# EAGLE design stm8sboard (EAGLE 6.5.0)
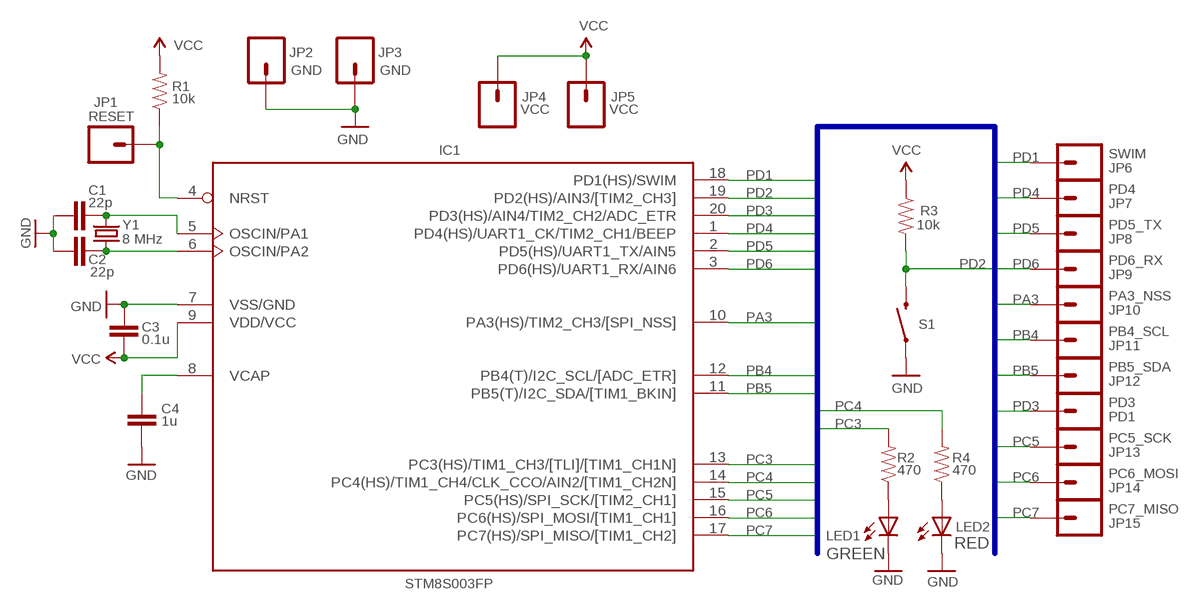
[diagram p0: schematic, sheet 1]

## Parts
C1  22p  CAP0805  [0805]
C2  22p  CAP0805  [0805]
C3  0.1u  CAP0603-CAP  [0603-CAP]
C4  1u  CAP0603-CAP  [0603-CAP]
IC1  STM8S003FP  STM8S103FP  [TSSOP20]
JP1  RESET  M01PTH  [1X01]
JP2  GND  M01PTH  [1X01]
JP3  GND  M01PTH  [1X01]
JP4  VCC  M01PTH  [1X01]
JP5  VCC  M01PTH  [1X01]
JP6  SWIM  M01PTH  [1X01]
JP7  PD4  M01PTH  [1X01]
JP8  PD5_TX  M01PTH  [1X01]
JP9  PD6_RX  M01PTH  [1X01]
JP10  PA3_NSS  M01PTH  [1X01]
JP11  PB4_SCL  M01PTH  [1X01]
JP12  PB5_SDA  M01PTH  [1X01]
JP13  PC5_SCK  M01PTH  [1X01]
JP14  PC6_MOSI  M01PTH  [1X01]
JP15  PC7_MISO  M01PTH  [1X01]
LED1  GREEN  LED0603  [LED-0603]
LED2  RED  LED0603  [LED-0603]
PD1  PD3  M01PTH  [1X01]
R1  10k  RESISTOR0805-RES  [0805]
R2  470  RESISTOR0805-RES  [0805]
R3  10k  RESISTOR0805-RES  [0805]
R4  470  RESISTOR0805-RES  [0805]
S1  SW  SWITCH-MOMENTARY-2PTH_REED2  [REED_SWITCH_PLASTIC]
Y1  8 MHz  CRYSTALHC49UV  [HC49U-V]

## Nets
GND: C1.1 C2.1 C3.1 C4.2 IC1.7(VSS/GND) JP2.1 JP3.1 LED1.C LED2.C S1.P$1
N$1: LED1.A R2.1
N$2: LED2.A R4.1
N$3: C2.2 IC1.6(OSCIN/PA2) Y1.1
N$4: C1.2 IC1.5(OSCIN/PA1) Y1.2
N$7: C4.1 IC1.8(VCAP)
N$10: IC1.4(NRST) JP1.1 R1.1
PA3: IC1.10(PA3(HS)/TIM2_CH3/[SPI_NSS]) JP10.1
PB4: IC1.12(PB4(T)/I2C_SCL/[ADC_ETR]) JP11.1
PB5: IC1.11(PB5(T)/I2C_SDA/[TIM1_BKIN]) JP12.1
PC3: IC1.13(PC3(HS)/TIM1_CH3/[TLI]/[TIM1_CH1N]) R2.2
PC4: IC1.14(PC4(HS)/TIM1_CH4/CLK_CCO/AIN2/[TIM1_CH2N]) R4.2
PC5: IC1.15(PC5(HS)/SPI_SCK/[TIM2_CH1]) JP13.1
PC6: IC1.16(PC6(HS)/SPI_MOSI/[TIM1_CH1]) JP14.1
PC7: IC1.17(PC7(HS)/SPI_MISO/[TIM1_CH2]) JP15.1
PD1: IC1.18(PD1(HS)/SWIM) JP6.1
PD2: IC1.19(PD2(HS)/AIN3/[TIM2_CH3]) R3.2 S1.P$2
PD3: IC1.20(PD3(HS)/AIN4/TIM2_CH2/ADC_ETR) PD1.1
PD4: IC1.1(PD4(HS)/UART1_CK/TIM2_CH1/BEEP) JP7.1
PD5: IC1.2(PD5(HS)/UART1_TX/AIN5) JP8.1
PD6: IC1.3(PD6(HS)/UART1_RX/AIN6) JP9.1
VCC: C3.2 IC1.9(VDD/VCC) JP4.1 JP5.1 R1.2 R3.1

## Buses
PD[1..6],PC[3..7],PA3,PB[4..5]

## Library data of the parts
C1-C4 = SparkFun:CAP: Capacitor Standard 0603 ceramic capacitor, and 0.1" leaded capacitor.
IC1 = stm8s103:STM8S103F*: STM8S103F*
JP1-JP15 PD1 = SparkFun:M01: Header 1 Standard 1-pin 0.1" header. Use with straight break away headers (SKU : PRT-00116), right angle break away headers (PRT-00553), swiss pins (PRT-00743), machine pins (PRT-00117), and female headers (PRT-00115).
LED1 LED2 = SparkFun:LED: LEDs Standard schematic elements and footprints for 5mm, 3mm, 1206, and 0603 sized LEDs. 5mm - Spark Fun Electronics SKU : COM-00529 (and others)
R1-R4 = SparkFun:RESISTOR: Resistor Basic schematic elements and footprints for 0603, 1206, and PTH resistors.
S1 = _MyLib:SWITCH-MOMENTARY-2: Various NO switches- pushbuttons, reed, etc
Y1 = SparkFun:CRYSTAL: Crystals Various standard crystals. Proven footprints. Spark Fun Electronics SKU : COM-00534

## Board
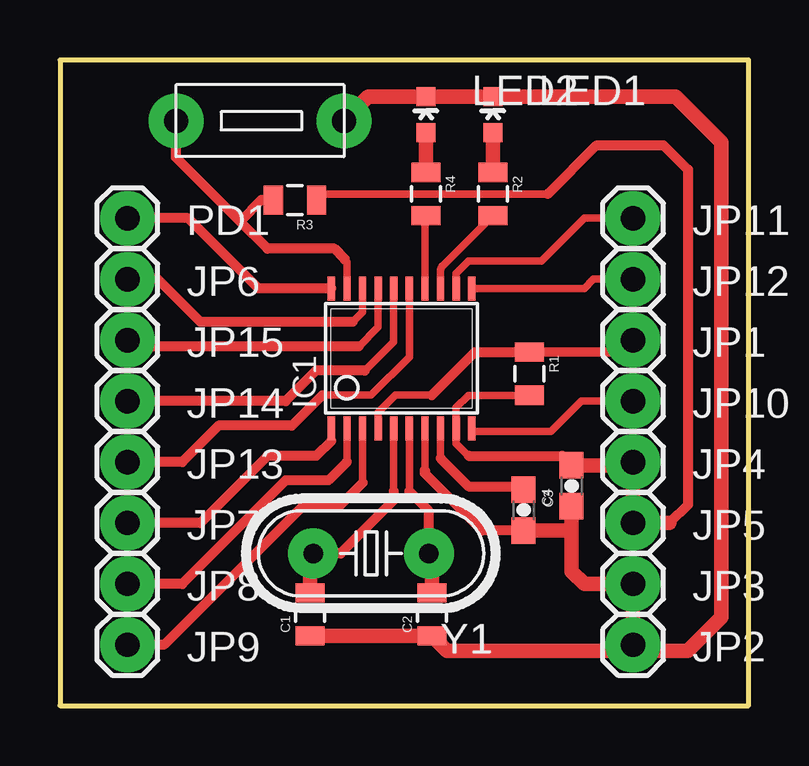
[diagram p1: board, top side]

Size 28.72 x 26.92 mm. Coordinates in mm from the lower left corner, seen from the top.
Outline: 0,26.92 0,0 28.72,0 28.72,26.92 0,26.92
Copper layers (1*16): Top 0.035mm / dielectric 1.5mm / Bottom 0.035mm
Design rules "default": minimum track width 10mil, minimum drill 8mil, track to track 6mil, track to pad 6mil, pad to pad 6mil, via to via 6mil, smd to smd 0mil, copper to edge 20mil, drill to drill 40mil, minimum pad ring 25mil, minimum via ring 12mil, stop-mask expansion 4mil, vias tented up to drill 0mil, thermal gap 10mil

### Footprints (pad centres in the part's own frame; a part is rotated, then mirrored left to right if it is on the bottom)
0805 = smd 0.8 x 1.2: 1 -0.9,0; 2 0.9,0
0603-CAP = smd 1.1 x 1: 1 -0.85,0; 2 0.85,0
TSSOP20 = smd 0.305 x 0.991: 1 -2.925,-2.918; 2 -2.275,-2.918; 3 -1.625,-2.918; 4 -0.975,-2.918; 5 -0.325,-2.918; 6 0.325,-2.918; 7 0.975,-2.918; 8 1.625,-2.918; 9 2.275,-2.918; 10 2.925,-2.918; 11 2.925,2.918; 12 2.275,2.918; 13 1.625,2.918; 14 0.975,2.918; 15 0.325,2.918; 16 -0.325,2.918; 17 -0.975,2.918; 18 -1.625,2.918; 19 -2.275,2.918; 20 -2.925,2.918
1X01 = drill 1.016 pad 1.88: 1 0,0
LED-0603 = smd 0.8 x 0.8: A 0,-0.75; C 0,0.75
REED_SWITCH_PLASTIC = drill 1.016 pad 1.88: P$1 -7,0; P$2 0,0
HC49U-V = drill 0.813: 1 -2.413,0; 2 2.413,0

### Placement (x,y rotation side)
C1  10.43,3.81 90 top
C2  15.51,3.81 90 top
C3  21.33,9.17 90 top
C4  19.33,8.15 270 top
IC1  14.24,14.48 0 top
JP1  23.89,15.24 0 top
JP2  23.89,2.54 0 top
JP3  23.89,5.08 0 top
JP4  23.89,10.16 0 top
JP5  23.89,7.62 0 top
JP6  2.81,17.78 0 top
JP7  2.81,7.62 0 top
JP8  2.81,5.08 0 top
JP9  2.81,2.54 0 top
JP10  23.89,12.7 0 top
JP11  23.89,20.32 0 top
JP12  23.89,17.78 0 top
JP13  2.81,10.16 0 top
JP14  2.81,12.7 0 top
JP15  2.81,15.24 0 top
LED1  18.05,24.64 0 top
LED2  15.26,24.64 0 top
PD1  2.81,20.32 0 top
R1  19.57,13.84 270 top
R2  18.05,21.34 270 top
R3  9.79,21.08 180 top
R4  15.26,21.34 270 top
S1  4.84,24.38 180 top
Y1  12.97,6.35 180 top

### Tracks (layer width: path | path; a pad name or v marks a point on that pad's centre or on a via)
GND
  Top 0.305: IC1.7 15.21,9.82
  Top 0.406: C4.2 17.6,7.3 15.21,9.69 15.21,9.82 | 24.4,2.29 24.15,2.29 JP2.1 | C3.1 21.33,7.3
  Top 0.61: C1.1 C2.1 16.13,2.29 24.4,2.29 26.18,2.29 27.57,3.68 27.57,23.5 25.68,25.39 LED1.C LED2.C 12.85,25.39 S1.P$1 | C3.1 21.33,5.61 21.86,5.08 JP3.1 JP2.1 | 21.33,7.3 C4.2
N$1
  Top 0.61: R2.1 LED1.A
N$2
  Top 0.61: R4.1 LED2.A
N$3
  Top 0.305: IC1.6 14.56,8.94
  Top 0.406: 15.51,6.22 Y1.1 15.38,8.12 14.56,8.94
  Top 0.61: C2.2 15.51,6.22
N$4
  Top 0.305: IC1.5 13.91,8.94
  Top 0.406: 13.91,8.94 13.91,8.56 11.7,6.35 Y1.2 10.43,6.22
  Top 0.61: C1.2 10.43,6.22
N$7
  Top 0.305: IC1.8 15.87,10.31
  Top 0.406: 15.87,10.31 17.03,9.14 19.19,9.14 C4.1
N$10
  Top 0.305: 15.51,12.95 13.99,12.95 13.27,12.23 IC1.4
  Top 0.406: 15.51,12.95 17.3,14.74 R1.1 19.31,14.74 23.13,14.73 JP1.1
PA3
  Top 0.305: 17.29,11.43 17.17,11.43 arc-90 17.16,11.44 IC1.10
  Top 0.308: 17.29,11.43 20.46,11.43 21.73,12.7 JP10.1
PB4
  Top 0.305: 20.08,18.54 17.03,18.54 16.51,18.02 IC1.12
  Top 0.308: 20.08,18.54 21.86,20.32 JP11.1
PB5
  Top 0.308: JP12.1 22.24,17.78 21.86,17.4 IC1.11
PC3
  Top 0.305: IC1.13 15.87,18.12 arc-45 15.95,18.34 R2.2
PC4
  Top 0.305: IC1.14 15.21,20.34 arc-45 R4.2
PC5
  Top 0.305: IC1.15 14.56,14.55 12.97,12.95 10.94,12.95
  Top 0.406: 10.94,12.95 9.67,11.68 6.62,11.68 5.1,10.16 JP13.1
PC6
  Top 0.305: IC1.16 13.91,15.17 12.72,13.97
  Top 0.406: 12.72,13.97 10.68,13.97 9.41,12.7 JP14.1
PC7
  Top 0.305: IC1.17 13.27,15.79 12.46,14.99 | 3.06,14.99 JP15.1
  Top 0.406: 12.46,14.99 3.06,14.99
PD1
  Top 0.305: IC1.18 12.62,16.41 12.21,16
  Top 0.406: 12.21,16 5.86,16 4.08,17.78 JP6.1
PD2
  Top 0.308: 11.87,18.6 11.96,18.5 IC1.19
  Top 0.406: 11.87,18.6 11.87,18.62 arc45 11.87,18.63 11.45,19.05 8.66,19.05 arc-45 8.65,19.05 7.51,20.19 | 7.51,20.19 4.84,22.86 S1.P$2 | R3.2 8.4,21.08 arc45 8.39,21.08 7.51,20.19
PD3
  Top 0.406: IC1.20 8.28,17.4 arc-45 8.27,17.4 5.35,20.32 PD1.1
PD4
  Top 0.305: IC1.1 11.31,11.04
  Top 0.406: 11.31,11.04 10.68,10.41 8.65,10.41 5.86,7.62 JP7.1
PD5
  Top 0.305: IC1.2 11.96,10.17
  Top 0.406: 11.96,10.17 11.19,9.4 9.41,9.4 5.1,5.08 JP8.1
PD6
  Top 0.305: IC1.3 12.62,9.3
  Top 0.406: 12.62,9.3 11.7,8.38 10.18,8.38 4.33,2.54 JP9.1
VCC
  Top 0.305: 17.03,10.41 16.51,10.93 IC1.9 16.51,12.44 17.02,12.94 R1.2 | R3.1 10.86,21.25 arc-45 11.07,21.34 20.34,21.34
  Top 0.406: 17.03,10.41 20.94,10.41 C3.2 | 25.42,7.62 26.18,8.38 26.18,22.35 25.16,23.37 22.37,23.37 20.34,21.34 | 23.75,10.02 JP4.1
  Top 0.61: JP4.1 JP5.1 25.42,7.62 | C3.2 23.75,10.02